# EAGLE design usb (EAGLE 6.5.0)
AUTHOR: Neal Jackson; REV: A; TITLE: BMO USB
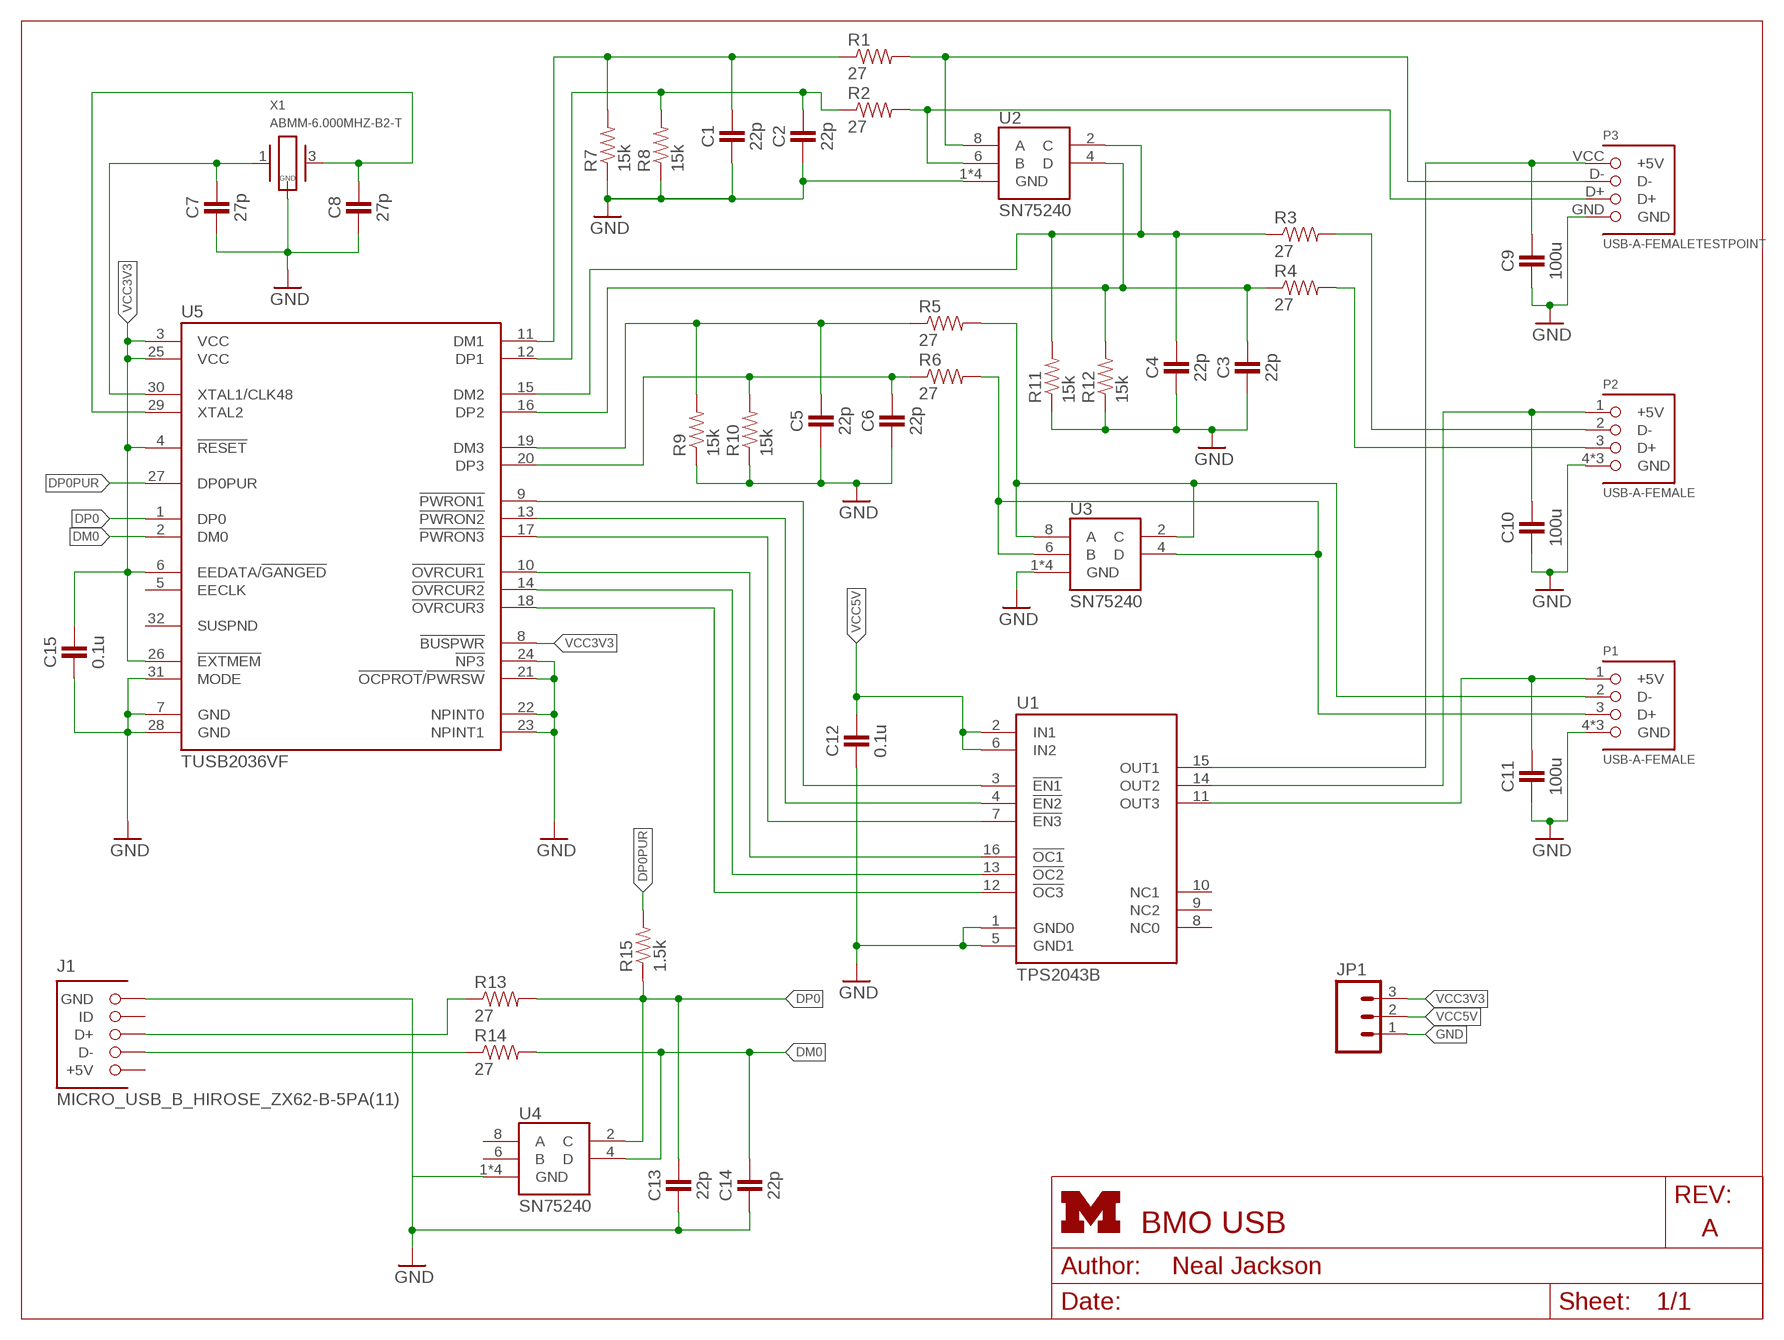
[diagram p0: schematic, sheet 1]
FRAME1 (LETTER_L): HEIGHT: 8.5in; WIDTH: 11in

## Parts
C1  22p  CAPACITOR  [0402_CAP]
C2  22p  CAPACITOR  [0402_CAP]
C3  22p  CAPACITOR  [0402_CAP]
C4  22p  CAPACITOR  [0402_CAP]
C5  22p  CAPACITOR  [0402_CAP]
C6  22p  CAPACITOR  [0402_CAP]
C7  27p  CAPACITOR  [0402_CAP]
C8  27p  CAPACITOR  [0402_CAP]
C9  100u  CAPACITOR  [0402_CAP]
C10  100u  CAPACITOR  [0402_CAP]
C11  100u  CAPACITOR  [0402_CAP]
C12  0.1u  CAPACITOR  [0402_CAP]
C13  22p  CAPACITOR  [0402_CAP]
C14  22p  CAPACITOR  [0402_CAP]
C15  0.1u  CAPACITOR  [0402_CAP]
J1  MICRO_USB_B_HIROSE_ZX62-B-5PA(11)  [USB_MICRO_B-HIROSE-ZX62-B-5PA(11)]
JP1  M03PTH  [1X03]
P1  USB-A-FEMALE  [87583-3010RPALF]
P2  USB-A-FEMALE  [87583-3010RPALF]
P3  USB-A-FEMALETESTPOINT  [USB-A-TESTPOINT]
R1  27  RESISTOR0402_RES  [0402_RES]
R2  27  RESISTOR0402_RES  [0402_RES]
R3  27  RESISTOR0402_RES  [0402_RES]
R4  27  RESISTOR0402_RES  [0402_RES]
R5  27  RESISTOR0402_RES  [0402_RES]
R6  27  RESISTOR0402_RES  [0402_RES]
R7  15k  RESISTOR0402_RES  [0402_RES]
R8  15k  RESISTOR0402_RES  [0402_RES]
R9  15k  RESISTOR0402_RES  [0402_RES]
R10  15k  RESISTOR0402_RES  [0402_RES]
R11  15k  RESISTOR0402_RES  [0402_RES]
R12  15k  RESISTOR0402_RES  [0402_RES]
R13  27  RESISTOR0402_RES  [0402_RES]
R14  27  RESISTOR0402_RES  [0402_RES]
R15  1.5k  RESISTOR0402_RES  [0402_RES]
U1  TPS2043B  [SO16]
U2  SN75240  [TSSOP8]
U3  SN75240  [TSSOP8]
U4  SN75240  [TSSOP8]
U5  TUSB2036VF  [VF_S-PQFP-G32]
X1  ABMM-6.000MHZ-B2-T  [ABMM-6.000MHZ-B2-T]

## Nets
DM0: C14.1 R14.2 U4.4(D) U5.2(DM0)
DP0: C13.1 R13.2 R15.1 U4.2(C) U5.1(DP0)
DP0PUR: R15.2 U5.27(DP0PUR)
GND: C1.2 C2.2 C3.2 C4.2 C5.2 C6.2 C7.2 C8.2 C9.2 C10.2 C11.2 C12.2 C13.2 C14.2 C15.2 J1.5(GND) JP1.1 P1.4(GND) P1.P$1(GND) P1.P$2(GND) P2.4(GND) P2.P$1(GND) P2.P$2(GND) P3.GND R7.1 R8.1 R9.1 R10.1 R11.1 R12.1 U1.1(GND0) U1.5(GND1) U2.1(GND) U2.3(GND) U2.5(GND) U2.7(GND) U3.1(GND) U3.3(GND) U3.5(GND) U3.7(GND) U4.1(GND) U4.3(GND) U4.5(GND) U4.7(GND) U5.7(GND) U5.21(!OCPROT!/!PWRSW!) U5.22(NPINT0) U5.23(NPINT1) U5.24(!NP3) U5.28(GND) U5.31(MODE) X1.2(GND) X1.4(GND)
N$1: C7.1 U5.30(XTAL1/CLK48) X1.1
N$2: C8.1 U5.29(XTAL2) X1.3
N$3: C11.1 P1.1(+5V) U1.11(OUT3)
N$4: C10.1 P2.1(+5V) U1.14(OUT2)
N$5: C9.1 P3.VCC(+5V) U1.15(OUT1)
N$7: P1.2(D-) R5.2 U3.2(C) U3.8(A)
N$8: P1.3(D+) R6.2 U3.4(D) U3.6(B)
N$9: P2.3(D+) R4.2
N$10: P2.2(D-) R3.2
N$11: P3.D+ R2.2 U2.6(B)
N$12: P3.D- R1.2 U2.8(A)
N$13: U1.3(!EN1) U5.9(!PWRON1)
N$14: U1.4(!EN2) U5.13(!PWRON2)
N$15: U1.7(!EN3) U5.17(!PWRON3)
N$16: C1.1 R1.1 R7.2 U5.11(DM1)
N$17: U1.16(!OC1) U5.10(!OVRCUR1)
N$18: C2.1 R2.1 R8.2 U5.12(DP1)
N$19: U1.13(!OC2) U5.14(!OVRCUR2)
N$20: C5.1 R5.1 R9.2 U5.19(DM3)
N$21: U1.12(!OC3) U5.18(!OVRCUR3)
N$22: C6.1 R6.1 R10.2 U5.20(DP3)
N$24: C4.1 R3.1 R11.2 U2.2(C) U5.15(DM2)
N$25: C3.1 R4.1 R12.2 U2.4(D) U5.16(DP2)
N$26: J1.2(D-) R14.1
N$27: J1.3(D+) R13.1
VCC3V3: C15.1 JP1.3 U5.3(VCC) U5.4(!RESET) U5.6(EEDATA/!GANGED) U5.8(!BUSPWR) U5.25(VCC) U5.26(!EXTMEM)
VCC5V: C12.1 JP1.2 U1.2(IN1) U1.6(IN2)
Unconnected: J1.1(+5V) J1.4(ID) U1.8(NC0) U1.9(NC2) U1.10(NC1) U4.6(B) U4.8(A) U5.5(EECLK) U5.32(SUSPND)

## Library data of the parts
C1-C15 = passives:CAPACITOR: 0402 Capacitor
J1 = connector:MICRO_USB_B_HIROSE_ZX62-B-5PA(11): Connector Receptacle USB - micro B 2.0 5 Position Surface Mount, Right Angle, Horizontal Bottom Mount; DIGIKEY: H11634CT-ND; MOUSER: 798-ZX62-B-5PA11; NEWARK: 86P8793
JP1 = SparkFun-Connectors:M03: Header 3 Standard 3-pin 0.1" header. Use with straight break away headers (SKU : PRT-00116), right angle break away headers (PRT-00553), swiss pins (PRT-00743), machine pins (PRT-00117), and female headers (PRT-00115). Molex polarized connector foot print use with SKU : PRT-08232 with associated crimp pins and housings.
P1-P3 = BMO:USB-A-FEMALE
R1-R15 = passives:RESISTOR: Resistor Basic schematic elements and footprints for 0603, 1206, and PTH resistors.
U1 = BMO:TPS2043B
U2-U4 = BMO:SN75240
U5 = BMO:TUSB2036VF: 2/3 port Hub for the Universal serial bus with optional serial EEPROM Interface
X1 = BMO:ABMM-6.000MHZ-B2-T

## Board
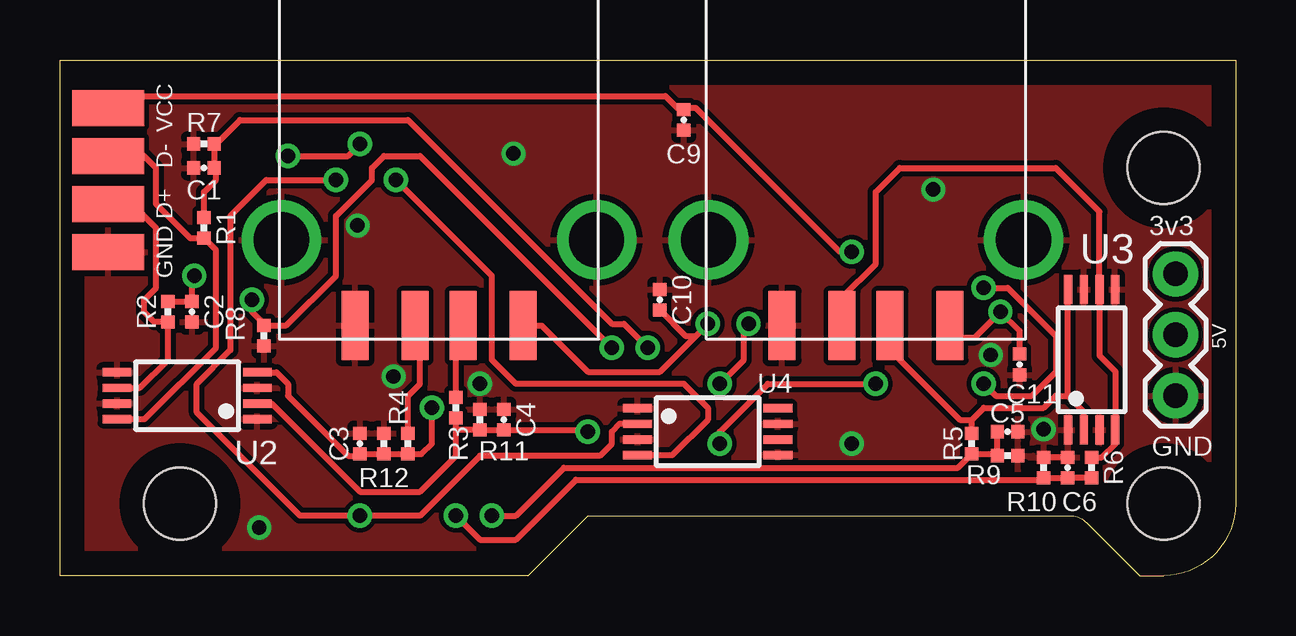
[diagram p1: board, top side]
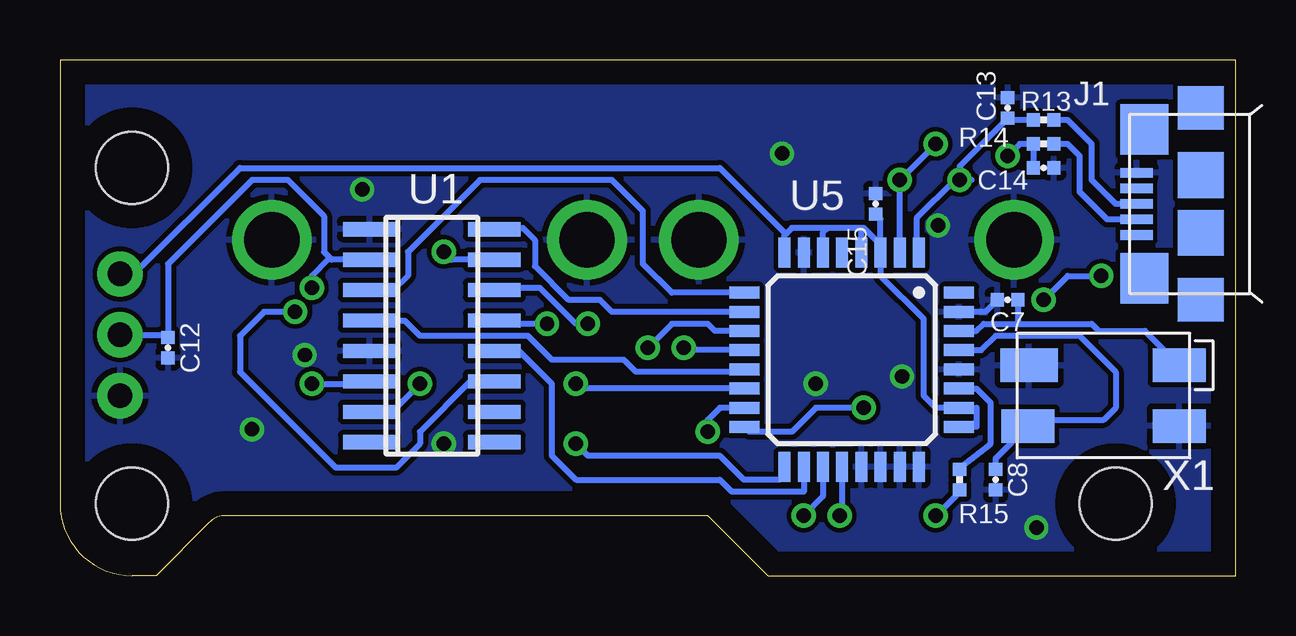
[diagram p2: board, bottom side, seen from below]

Size 49 x 21.5 mm. Coordinates in mm from the lower left corner, seen from the top.
Outline: 0,21.5 49,21.5 49,3 arc-90 46,0 45,0 42.79,2.21 arc45 42.09,2.5 22,2.5 19.5,0 0,0 0,21.5
Copper layers (1*16): Top 0.035mm / dielectric 1.5mm / Bottom 0.035mm
Design rules "default": minimum track width 10mil, minimum drill 24mil, track to track 8mil, track to pad 8mil, pad to pad 8mil, via to via 8mil, smd to smd 8mil, copper to edge 40mil, drill to drill 8mil, minimum pad ring 10mil, minimum via ring 8mil, stop-mask expansion 4mil, vias tented up to drill 0mil, thermal gap 10mil
Holes 3 mm at 5,3 46,3 46,17

### Footprints (pad centres in the part's own frame; a part is rotated, then mirrored left to right if it is on the bottom)
0402_CAP = smd 0.536 x 0.546: 1 -0.433,0; 2 0.433,0
USB_MICRO_B-HIROSE-ZX62-B-5PA(11) = smd 0.4 x 1.35: 1 -1.3,4.125; 2 -0.65,4.125; 3 0,4.125; 4 0.65,4.125; 5 1.3,4.125 | smd 2.1 x 2: P$1 3.1,3.8; P$2 -3.1,3.8 | smd 1.8 x 1.9: P$3 -4,1.45; P$6 4,1.45 | smd 1.9 x 1.9: P$4 -1.2,1.45; P$5 1.2,1.45
1X03 = drill 1.016 pad 1.88: 1 0,0; 2 2.54,0; 3 5.08,0
87583-3010RPALF = smd 1.12 x 2.88: 1 -3.5,3.58; 2 -1,3.58; 3 1,3.58; 4 3.5,3.58 | drill 2.3: P$1 -6.57,0; P$2 6.57,0
USB-A-TESTPOINT = smd 1.5 x 3: D+ 4,0; D- 2,0; GND 6,0; VCC 0,0
0402_RES = smd 0.536 x 0.546: 1 -0.433,0; 2 0.433,0
SO16 = smd 0.6 x 2.2: 1 -4.445,-2.6; 2 -3.175,-2.6; 3 -1.905,-2.6; 4 -0.635,-2.6; 5 0.635,-2.6; 6 1.905,-2.6; 7 3.175,-2.6; 8 4.445,-2.6; 9 4.445,2.6; 10 3.175,2.6; 11 1.905,2.6; 12 0.635,2.6; 13 -0.635,2.6; 14 -1.905,2.6; 15 -3.175,2.6; 16 -4.445,2.6
TSSOP8 = smd 1.2 x 0.35: 1 -2.925,0.975; 2 -2.925,0.325; 3 -2.925,-0.325; 4 -2.925,-0.975; 5 2.925,-0.975; 6 2.925,-0.325; 7 2.925,0.325; 8 2.925,0.975
VF_S-PQFP-G32 = smd 1.25 x 0.5: 1 -4.475,2.8; 2 -4.475,2; 3 -4.475,1.2; 4 -4.475,0.4; 5 -4.475,-0.4; 6 -4.475,-1.2; 7 -4.475,-2; 8 -4.475,-2.8; 17 4.475,-2.8; 18 4.475,-2; 19 4.475,-1.2; 20 4.475,-0.4; 21 4.475,0.4; 22 4.475,1.2; 23 4.475,2; 24 4.475,2.8 | smd 0.5 x 1.25: 9 -2.8,-4.475; 10 -2,-4.475; 11 -1.2,-4.475; 12 -0.4,-4.475; 13 0.4,-4.475; 14 1.2,-4.475; 15 2,-4.475; 16 2.8,-4.475; 25 2.8,4.475; 26 2,4.475; 27 1.2,4.475; 28 0.4,4.475; 29 -0.4,4.475; 30 -1.2,4.475; 31 -2,4.475; 32 -2.8,4.475
ABMM-6.000MHZ-B2-T = smd 2.21 x 1.397: 1 -3.15,-1.27; 2 -3.15,1.27; 3 3.15,1.27 | smd 2.388 x 1.397: 4 3.105,-1.27

### Placement (x,y rotation side)
C1  6,17 180 top
C2  5.5,11 270 top
C3  12.5,5.5 90 top
C4  18.5,6.5 90 top
C5  39.5,6 0 top
C6  42,4.5 90 top
C7  9.5,11.5 180 bottom
C8  10,4 270 bottom
C9  26,19 270 top
C10  25,11.5 90 top
C11  40,8.8 270 top
C12  44.5,9.5 270 bottom
C13  9.5,19.5 90 bottom
C14  8,17 0 bottom
C15  15,15.5 90 bottom
J1  0,15.5 90 bottom
JP1  46.5,7.5 90 top
P1  33.6,14 180 top
P2  15.8,14 180 top
P3  2,19.5 270 top
R1  6,14.5 270 top
R2  4.5,11 270 top
R3  16.5,7 90 top
R4  14.5,5.5 90 top
R5  38,5.5 90 top
R6  43,4.5 90 top
R7  6,18 0 top
R8  8.5,10 90 top
R9  39.5,5 180 top
R10  41,4.5 270 top
R11  17.5,6.5 270 top
R12  13.5,5.5 270 top
R13  8,19 180 bottom
R14  8,18 180 bottom
R15  11.5,4 90 bottom
U1  33.5,10 270 bottom
U2  5.3,7.5 180 top
U3  43,9 90 top
U4  27,6 0 top
U5  16,9 270 bottom
X1  5.5,7.5 180 bottom

### Tracks (layer width: path | path; a pad name or v marks a point on that pad's centre or on a via)
DM0  (via drill 0.6)
  Top 0.254: U4.4 25.52,5.03 27,6.5 27,7 26,8 19,8 18,9 18,12.5 v14,16.5 | v9.5,17.5 12,17.5 v12.5,18
  Bottom 0.254: U5.2 v14,16.5 v12.5,18 | C14.1 R14.2 9,18 v9.5,17.5
DP0  (via drill 0.6)
  Top 0.254: U4.2 23.32,6.33 23,6 23,5.5 22.5,5 17.5,5 15,2.5 v12.5,2.5 10,2.5 5.7,6.8 5.7,8 7.1,9.4 7.1,15 8.6,16.5 v11.5,16.5
  Bottom 0.254: R15.1 11.5,3.5 v12.5,2.5 | U5.1 13.3,13.57 13.3,14.9 11.7,16.5 v11.5,16.5 | v11.5,16.5 11,16.5 | R13.2 9.43,19 C13.1 11.5,17.07 v11.5,16.5
DP0PUR
  Bottom 0.254: R15.2 11.5,4.5 10.2,5.5 10.2,7.2 10.8,7.8 U5.27
GND  (via drill 0.6)
  Top 0.254: 40,4.93 R9.1 | C6.2 R10.1 | 2.17,13.32 P3.GND
  Bottom 0.254: C7.2 10.43,11 U5.31
  other vias: 8.3,2 12.4,14.6 17.5,8 33,5.5 38.8,9.2 18.9,17.6 36.4,16.1 41,6.1 13.9,8.3
  pour Top: -2,21.5 -2,0 49,0 49,21.5
  pour Bottom: -2,21.5 49,21.5 49,0 -2,0
N$1
  Bottom 0.254: X1.1 3.78,10.2 5.7,10.2 6,10.5 9,10.5 | U5.30 10.8,10.2 10.5,10.5 9,10.5 | C7.1 9.07,10.57 9,10.5
N$2
  Bottom 0.254: C8.1 10,4.88 X1.3 8.38,6.5 5.5,6.5 5,7 5,8.5 6.5,10 10,10 10.6,9.4 U5.29
N$3  (via drill 0.6)
  Top 0.254: P1.1 37.1,9.95 37.11,9.93 38.13,9.93 v39.2,11 | 39,10.8 v39.2,11 | C11.1 40,10.2 v39.2,11
  Bottom 0.254: U1.11 31.91,8.09 34,6 34,5.5 35,4.5 37.5,4.5 41.5,8.5 41.5,10 40.5,11 v39.2,11
N$4  (via drill 0.6)
  Top 0.254: P2.1 20.08,10.42 22,8.5 25,8.5 26.5,10 | 26.5,10 v27,10.5 | C10.1 26.07,10 26.5,10
  Bottom 0.254: U1.14 30.8,12 29,12 27.5,10.5 v27,10.5
N$5  (via drill 0.6)
  Top 0.254: P3.VCC 2.07,19.43 2.13,19.5 2.5,19.5 3,20 25.23,20 25.8,19.43 C9.1 25.87,19.5 26.5,19.5 32.5,13.5 v33,13.5
  Bottom 0.254: U1.15 32.67,13.18 v33,13.5
N$7
  Top 0.254: 37.93,6 R5.2 38,6.5 | P1.2 34.6,9.4 37.5,6.5 38,6.5 | 38,6.5 38.5,7 41,7 41.5,7.5 42,7.5 | 42,7.5 42.67,6.83 U3.2 | 42,7.5 42,11.9 U3.8
N$8
  Top 0.254: 42.93,4.93 42.93,5 R6.2 43.43,4.93 44,5.5 44,6.05 U3.4 44,6.1 44,8.5 43.33,9.18 U3.6 43.33,15.18 41.5,17 35,17 34,16 34,13 32.6,11.6 P1.3
N$9
  Top 0.254: 14.5,10.12 P2.3 15,10.22 15,8 14.5,7.5 R4.2
N$10
  Top 0.254: R3.2 16.5,10.12 P2.2
N$11
  Top 0.254: U2.6 3.33,7.83 4.5,9 R2.2 3.93,10.57 3.5,11 3.5,11.5 4,12 4,14.5 3.75,14.75 3,15.5 P3.D+
N$12
  Top 0.254: 1.93,17.57 P3.D- | 2.5,17 P3.D- | U2.8 3.52,6.53 6.5,9.5 6.5,13.57 R1.2 5.43,14.07 4,15.5 4,17 3.5,17.5 P3.D-
N$13
  Bottom 0.254: U5.9 23.5,11.8 24.7,13 24.7,15.2 26,16.5 31.5,16.5 34.5,13.5 34.5,12.5 35.09,11.9 U1.3
N$14
  Bottom 0.254: U5.13 20.57,8.5 25,8.5 25.5,9 28.5,9 29.5,10 34,10 34.64,10.63 U1.4
N$15  (via drill 0.6)
  Top 0.254: v34,8 29.5,8 27.5,6 v27.5,5.5
  Bottom 0.254: U5.17 18.8,4.2 19,4 20.5,4 21.5,5 27,5 v27.5,5.5 | v34,8 35,7 35.92,7 U1.7
N$16  (via drill 0.6)
  Top 0.254: v24.5,9.5 23.5,10.5 23,10.5 15.25,18.25 15,18.5 14.5,19 7.5,19 6.5,18 R7.2 C1.1 6.5,16.93 6.5,16.5 6,16 R1.1
  Bottom 0.254: U5.11 21.7,10.2 22,10.5 23.5,10.5 v24.5,9.5
N$17
  Bottom 0.254: U1.16 30.95,14.5 29.7,14.5 29.2,14 29.2,12.9 27.8,11.5 26.5,11.5 26,11 U5.10
N$18  (via drill 0.6)
  Top 0.254: v8,11.5 8,11 8.43,10.57 R8.2 9.43,10.43 11.5,12.5 11.5,15 13,16.5 13,17 13.5,17.5 15,17.5 v23,9.5 | R2.1 C2.1 5.5,12.4 v5.6,12.5
  Bottom 0.254: v8,11.5 7,12.5 v5.6,12.5 | U5.12 22.9,9.4 v23,9.5
N$19  (via drill 0.6)
  Top 0.254: v27.5,8 28.5,9 28.5,10.3 v28.7,10.5
  Bottom 0.254: U5.14 27.3,7.8 v27.5,8 | v28.7,10.5 30.77,10.5 U1.13
N$20  (via drill 0.6)
  Top 0.254: C5.1 R9.2 39,5.07 R5.1 37.43,4.5 21,4.5 19,2.5 v18,2.5
  Bottom 0.254: U5.19 17.2,3.3 v18,2.5
N$21
  Bottom 0.254: U5.18 18,3.5 21,3.5 21.5,4 27.5,4 28.5,5 28.5,8 29.86,9.37 U1.12
N$22  (via drill 0.6)
  Top 0.254: R6.1 C6.1 R10.2 40.93,4 21.5,4 19,1.5 17.5,1.5 v16.5,2.5
  Bottom 0.254: U5.20 16.4,2.6 v16.5,2.5
N$24  (via drill 0.6)
  Top 0.254: U2.2 8.82,7.17 12.5,3.5 15,3.5 16.5,5 16.5,6 | 16.5,6 R3.1 | v22,6 21.93,6.07 C4.1 R11.2 16.57,6.07 16.5,6
  Bottom 0.254: U5.15 21.5,7 22,6.5 v22,6
N$25  (via drill 0.6)
  Top 0.254: U2.4 9.03,8.47 9.5,8 9.5,7.5 12,5 12.43,5 C3.1 R12.2 R4.1 15.07,5.07 15.5,5.5 v15.5,7
  Bottom 0.254: v15.5,7 17.5,7 18.5,6 20.27,6 U5.16
N$26
  Bottom 0.254: J1.2 5.35,14.85 6.5,16 6.5,17.5 7,18 R14.1
N$27
  Bottom 0.254: J1.3 5,15.5 6,16.5 6,18 7,19 R13.1
VCC3V3
  Bottom 0.254: U5.25 10.8,6.2 10.8,7 U5.26 12.5,7 13,7.5 13,10.7 14.8,12.5 U5.3 | U5.3 14.8,14.87 C15.1 | U5.3 14.8,13.8 15.5,14.5 | 15.5,14.5 17,14.5 | 17,14.5 18.5,14.5 18.75,14.25 | U5.8 18.8,14.2 18.75,14.25 | U5.4 15.6,14.4 15.5,14.5 | U5.6 17.2,14.3 17,14.5 | 18.75,14.25 21.5,17 41.5,17 45.92,12.58 JP1.3
VCC5V  (via drill 0.6)
  Top 0.254: v38.5,12 39.5,12 41.5,10 41.5,8.5 40.5,7.5 39,7.5 v38.5,8
  Bottom 0.254: JP1.2 44.61,10.04 C12.1 44.5,13 41,16.5 39.5,16.5 38,15 38,13.5 37.67,13.18 | U1.2 37.67,13.18 | 37.67,13.18 37.83,13.18 38.5,12.5 v38.5,12 | v38.5,8 36.2,8 U1.6

### Text on the board
tPlace: 3v3 | 5V | GND
bDocu: BMO USB / REV A | N.Jackson / 7/16